# EAGLE design Top_rev1 (EAGLE 6.3)
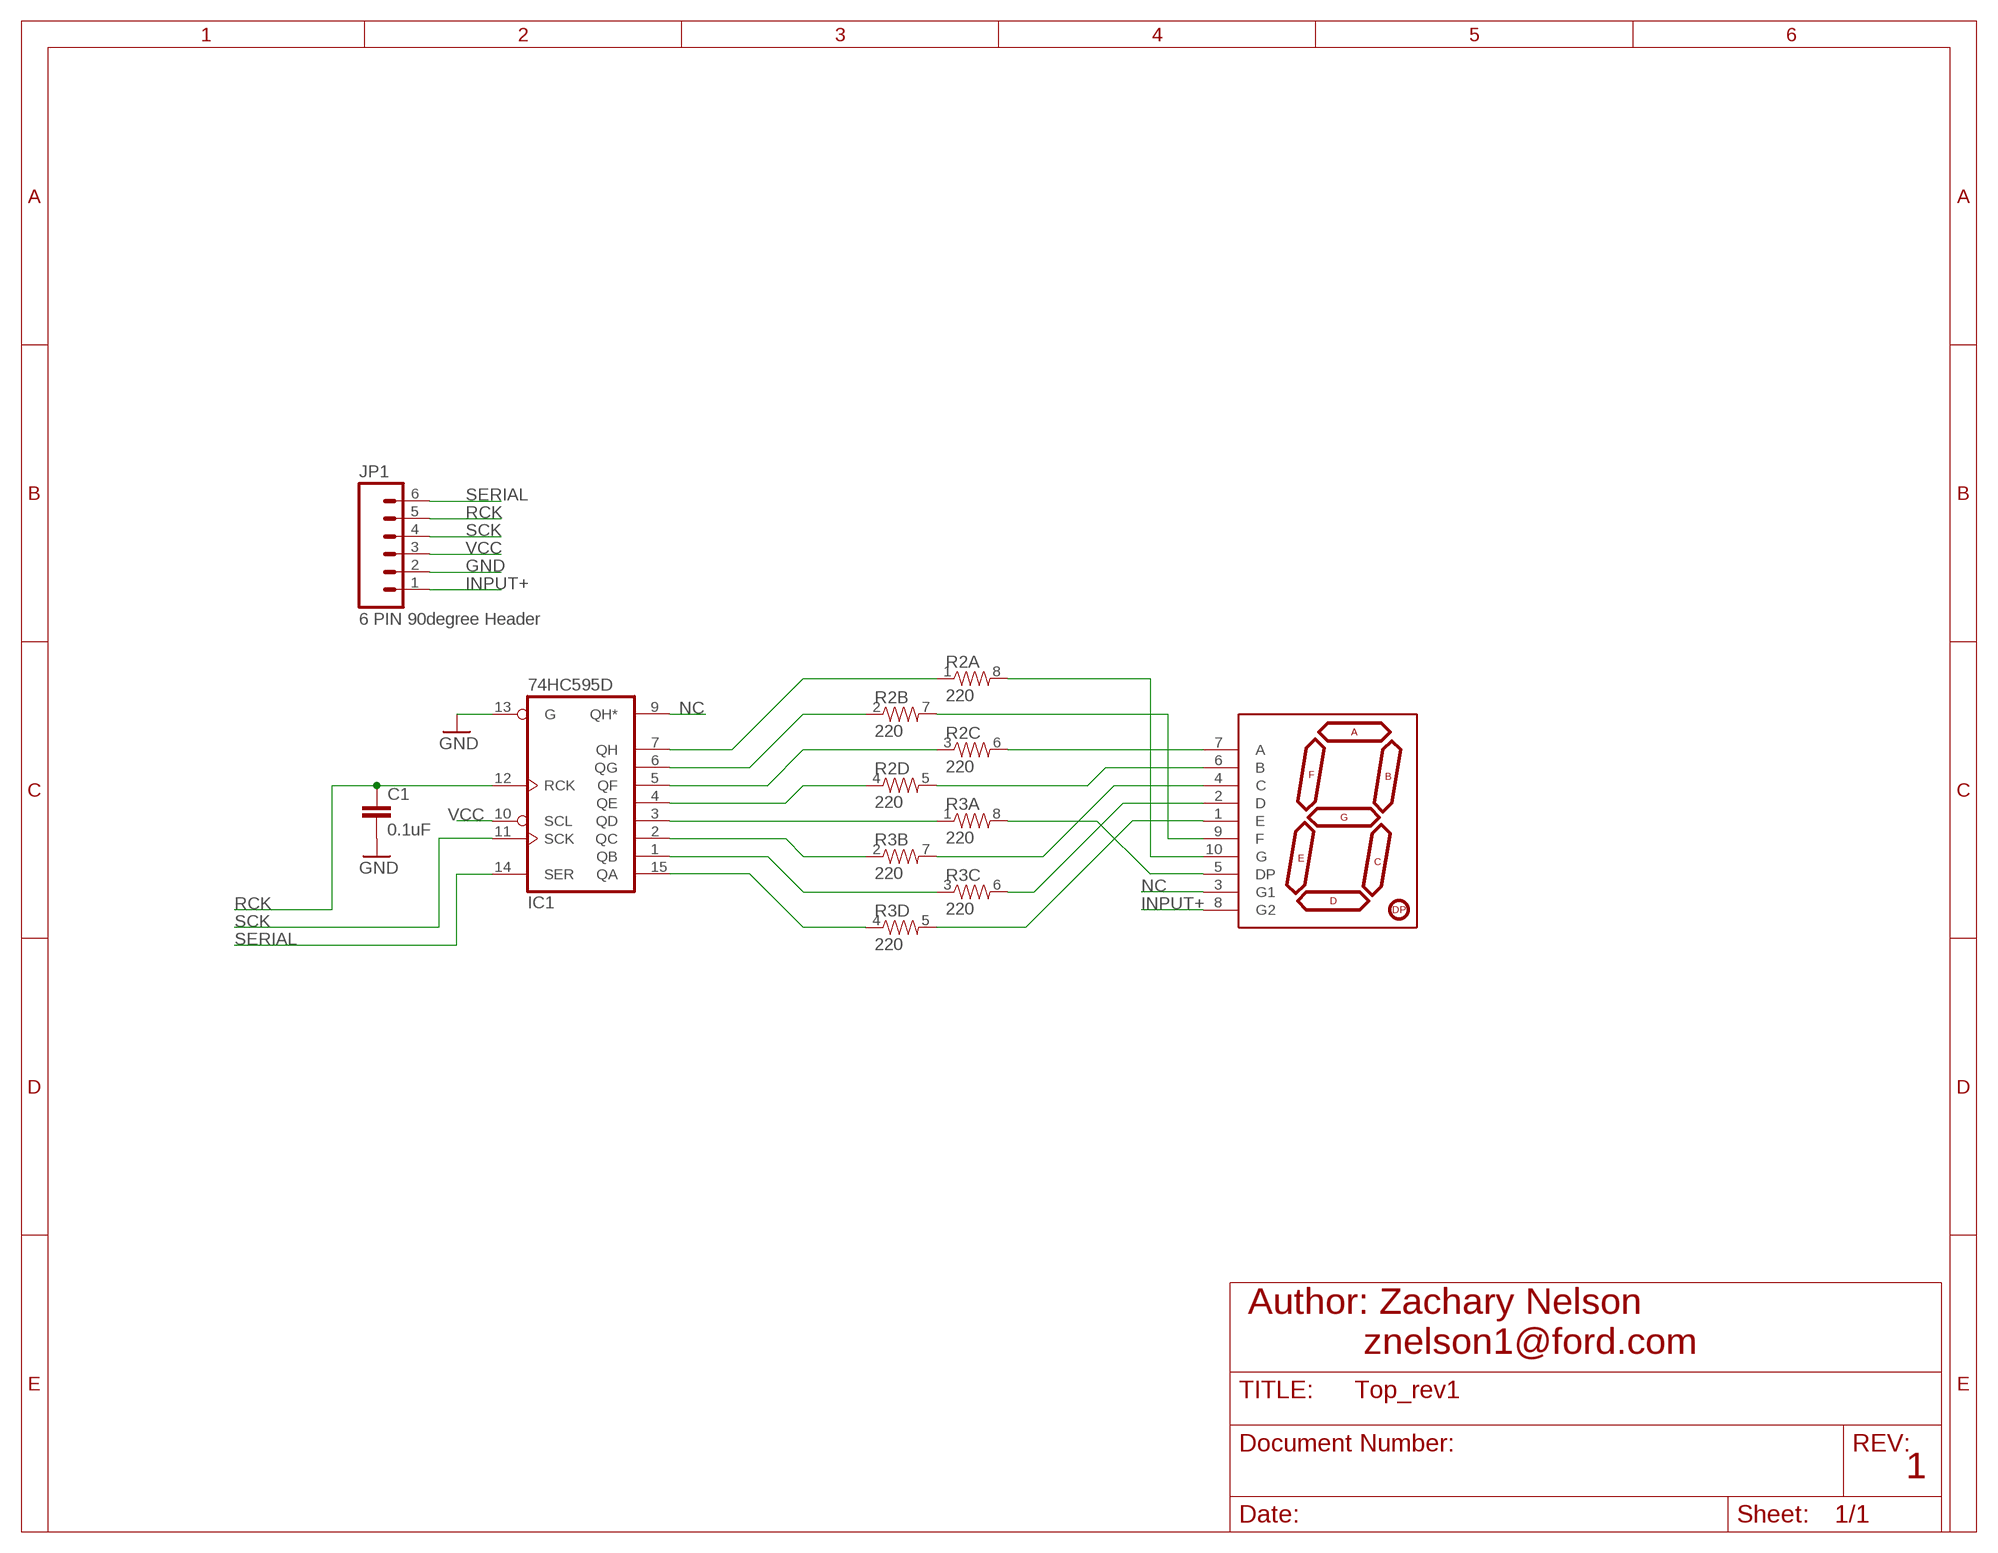
[diagram p0: schematic, sheet 1]

## Parts
C1  0.1uF  CAP0402-CAP  [0402-CAP]
IC1  74HC595D  [SO16]
JP1  6 PIN 90degree Header  M06POGOPIN_HOLES_ONLY  [1X06_HOLES_ONLY]
R2  220  RESISTOR-ARRAY0603-ARV  [0603-ARV]
R3  220  RESISTOR-ARRAY0603-ARV  [0603-ARV]
U$1  7-SEGMENT-DISPLAY-1"-RED  [7-SEGMENT-1"PTH]

## Nets
GND: C1.2 IC1.13(G) JP1.2
INPUT+: JP1.1 U$1.8(G2)
N$1: R3.8 U$1.5(DP)
N$2: IC1.1(QB) R3.3
N$3: R3.5 U$1.1(E)
N$4: IC1.2(QC) R3.2
N$5: IC1.3(QD) R3.1
N$7: R3.7 U$1.4(C)
N$8: R2.5 U$1.6(B)
N$9: IC1.15(QA) R3.4
N$10: IC1.4(QE) R2.4
N$11: IC1.5(QF) R2.3
N$12: IC1.6(QG) R2.2
N$13: IC1.7(QH) R2.1
N$14: R2.6 U$1.7(A)
N$15: R2.7 U$1.9(F)
N$16: R2.8 U$1.10(G)
N$19: R3.6 U$1.2(D)
NC: IC1.9(QH*) U$1.3(G1)
RCK: C1.1 IC1.12(RCK) JP1.5
SCK: IC1.11(SCK) JP1.4
SERIAL: IC1.14(SER) JP1.6
VCC: IC1.10(SCL) JP1.3

## Notes on the sheet
- Author: Zachary Nelson
             znelson1@ford.com
- 1

## Power pins joined to a net without a drawn wire
GND: IC1.8(GND)
VCC: IC1.16(VCC)

## Library data of the parts
C1 = SparkFun-Capacitors:CAP: Capacitor Standard 0603 ceramic capacitor, and 0.1" leaded capacitor.
IC1 = 74xx-eu:74*595: 8-bit SHIFT REGISTER, output latch
JP1 = SparkFun-Connectors:M06: Header 6 Standard 6-pin 0.1" header. Use with straight break away headers (SKU : PRT-00116), right angle break away headers (PRT-00553), swiss pins (PRT-00743), machine pins (PRT-00117), and female headers (PRT-00115). Molex polarized connector foot print use with SKU : PRT-08094 with associated crimp pins and housings. NOTES ON THE VARIANTS LOCK and LOCK_LONGPADS... This footprint was designed to help hold the alignment of a through-hole component (i.e. 6-pin header) while soldering it into place. You may notice that each hole has been shifted either up or down by 0.005 of an inch from it's more standard position (which is a perfectly straight line). This slight alteration caused the pins (the squares in the middle) to touch the edges of the holes. Because they are alternating, it causes a "brace" to hold the component in place. 0.005 has proven to be the perfect amount of "off-center" position when using our standard breakaway headers. Although looks a little odd when you look at the bare footprint, once you have a header in there, the alteration is very hard to notice. Also, if you push a header all the way into place, it is covered up entirely on the bottom side. This idea of altering the position of holes to aid alignment will be further integrated into the Sparkfun Library for other footprints. It can help hold any component with 3 or more connection pins.
R2 R3 = SparkFun-Resistors:RESISTOR-ARRAY: Array Chip Resistor Source: RS Component / Phycomp
U$1 = SparkFun-Displays:7-SEGMENT-DISPLAY-1"-RED: 7-Segment Display 1" Red (COM-08546)

## Board
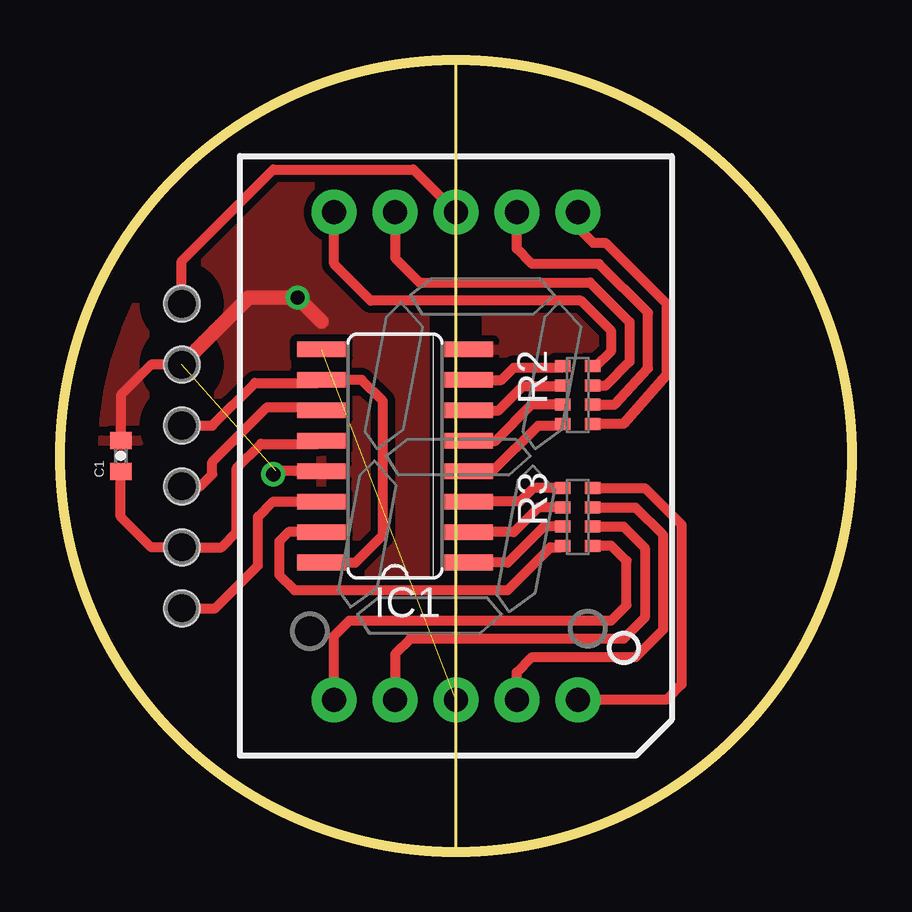
[diagram p1: board, top side]

Size 33.02 x 33.02 mm. Coordinates in mm from the lower left corner, seen from the top.
Outline: circle at 16.51,16.51 radius 16.51
Copper layers (1*16): Top 0.035mm / dielectric 1.5mm / Bottom 0.035mm
Design rules "default": minimum track width 10mil, minimum drill 24mil, track to track 8mil, track to pad 8mil, pad to pad 8mil, via to via 8mil, smd to smd 8mil, copper to edge 40mil, drill to drill 8mil, minimum pad ring 10mil, minimum via ring 8mil, stop-mask expansion 4mil, vias tented up to drill 0mil, thermal gap 10mil

### Footprints (pad centres in the part's own frame; a part is rotated, then mirrored left to right if it is on the bottom)
0402-CAP = smd 0.7 x 0.9: 1 -0.65,0; 2 0.65,0
SO16 = smd 0.66 x 2.032: 1 -4.445,-3.073; 2 -3.175,-3.073; 3 -1.905,-3.073; 4 -0.635,-3.073; 5 0.635,-3.073; 6 1.905,-3.073; 7 3.175,-3.073; 8 4.445,-3.073; 9 4.445,3.073; 10 3.175,3.073; 11 1.905,3.073; 12 0.635,3.073; 13 -0.635,3.073; 14 -1.905,3.073; 15 -3.175,3.073; 16 -4.445,3.073
1X06_HOLES_ONLY = drill 0.889 pad 0.813: 1 0,0; 2 2.54,0; 3 5.08,0; 4 7.62,0; 5 10.16,0; 6 12.7,0 | hole 1.473: 0,0; 2.54,0; 5.08,0; 7.62,0; 10.16,0; 12.7,0
0603-ARV = smd 0.5 x 0.65: 1 -1.2,-0.625; 2 -0.4,-0.625; 3 0.4,-0.625; 4 1.2,-0.625; 5 1.2,0.625; 6 0.4,0.625; 7 -0.4,0.625; 8 -1.2,0.625
7-SEGMENT-1"PTH = drill 1 pad 1.88: 1 -5.08,-10.16; 2 -2.54,-10.16; 3 0,-10.16; 4 2.54,-10.16; 5 5.08,-10.16; 6 5.08,10.16; 7 2.54,10.16; 8 0,10.16; 9 -2.54,10.16; 10 -5.08,10.16

### Placement (x,y rotation side)
C1  2.54,16.51 90 top
IC1  13.97,16.51 90 top
JP1  5.08,22.86 270 top
R2  21.59,19.05 270 top
R3  21.59,13.97 270 top
U$1  16.51,16.51 0 top

### Tracks (layer width: path | path; a pad name or v marks a point on that pad's centre or on a via)
GND  (via drill 0.6)  (1 unrouted)
  Top 0.406: IC1.13 9.02,15.88 8.89,15.75 | JP1.2 3.81,20.32 2.54,19.05 C1.2
  Top 0.61: 10.9,22.12 v9.91,23.11 7.87,23.11 JP1.2
  pour Top (isolate 0.305): 1.78,16.51 arc-90 16.51,31.24 16.76,31.24 arc-90 31.5,16.51 arc-90 16.51,1.52 arc-91
INPUT+
  Top 0.406: U$1.8 14.73,28.45 8.89,28.45 5.08,24.64 JP1.1
N$1
  Top 0.406: R3.8 24.38,15.17 25.91,13.65 25.91,6.99 25.27,6.35 U$1.5
N$2
  Top 0.406: R3.3 20.17,13.57 18.67,12.07 IC1.1
N$3
  Top 0.406: U$1.1 11.43,9.02 12.07,9.65 22.99,9.65 23.62,10.29 23.62,12.13 22.99,12.77 R3.5
N$4
  Top 0.406: R3.2 19.96,14.37 18.92,13.34 IC1.2
N$5
  Top 0.406: R3.1 19.74,15.17 19.18,14.61 IC1.3
N$6  (via drill 0.6)
  other vias: 8.89,15.75
N$7
  Top 0.406: U$1.4 19.05,7.49 19.68,8.13 24,8.13 25.15,9.27 25.15,13.21 24,14.35 22.21,14.35 R3.7
N$8
  Top 0.406: U$1.6 21.59,26.04 22.23,25.4 22.73,25.4 25.27,22.86 25.27,19.88 23.5,17.85 R2.5
N$9
  Top 0.406: IC1.15 9.53,13.34 9.14,12.95 9.14,11.56 9.78,10.92 18.67,10.92 20.45,12.7 20.89,12.7 R3.4
N$10
  Top 0.406: IC1.4 18.03,15.88 19.94,17.78 20.89,17.78 R2.4
N$11
  Top 0.406: IC1.5 18.16,17.14 19.68,18.67 20.95,18.67 R2.3
N$12
  Top 0.406: IC1.6 18.29,18.41 19.3,19.43 20.95,19.43 R2.2
N$13
  Top 0.406: IC1.7 18.41,19.68 18.92,20.19 20.91,20.19 R2.1
N$14
  Top 0.406: R2.6 23.11,18.65 24.51,20.17 24.51,22.48 22.48,24.51 19.68,24.51 19.05,25.15 U$1.7
N$15
  Top 0.406: U$1.9 13.97,24.77 14.99,23.75 22.1,23.75 23.75,22.1 23.75,20.45 22.73,19.43 22.23,19.43 R2.7
N$16
  Top 0.406: R2.8 22.35,20.25 22.99,20.89 22.99,21.72 21.72,22.99 12.95,22.99 11.43,24.51 U$1.10
N$19
  Top 0.406: R3.6 23.5,13.57 24.38,12.68 24.38,9.78 23.5,8.89 14.61,8.89 13.97,8.26 U$1.2
NC  (1 unrouted)
RCK
  Top 0.406: IC1.12 10.77,17.02 8.38,17.02 7.37,16 7.37,13.34 6.73,12.7 JP1.5 3.81,12.7 2.54,13.97 C1.1
SCK
  Top 0.406: JP1.4 5.84,15.24 6.35,15.75 6.35,16.26 8.64,18.54 10.77,18.54 IC1.11
SERIAL
  Top 0.406: JP1.6 6.48,10.16 8.26,11.94 8.26,13.97 8.89,14.61 IC1.14
VCC
  Top 0.406: IC1.16 12.32,12.07 13.46,13.21 13.46,18.8 12.57,19.68 IC1.10 10.77,19.56 8.13,19.56 6.35,17.78 JP1.3